# Altium schematic sheet Mis - AFE LMP91000.SchDoc
size Letter
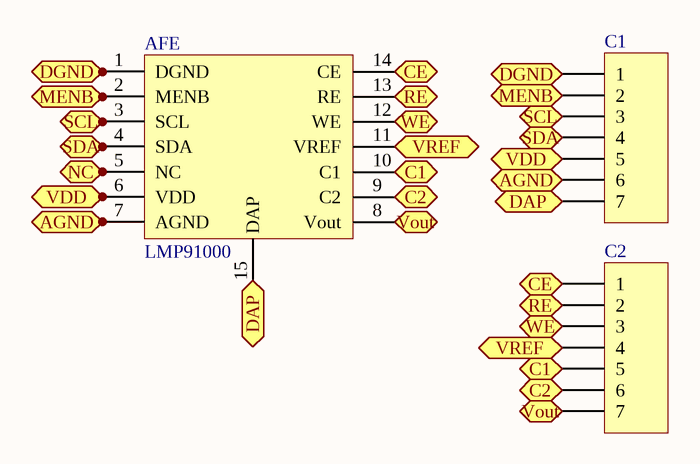
[diagram p0: Mis - AFE LMP91000.SchDoc]

## Parts
AFE  LMP91000  [WSON14]
C1  Header 7  [HDR1X7]  (value not drawn)
C2  Header 7  [HDR1X7]  (value not drawn)

## Ports
AGND, C1, C2, CE, DAP, DGND, MENB, NC, RE, SCL, SDA, VDD, Vout, VREF, WE

## Nets
AGND: AFE.7(AGND) C1.6 ; port AGND
C1: AFE.10(C1) C2.5 ; port C1
C2: AFE.9(C2) C2.6 ; port C2
CE: AFE.14(CE) C2.1 ; port CE
DAP: AFE.15(DAP) C1.7 ; port DAP
DGND: AFE.1(DGND) C1.1 ; port DGND
MENB: AFE.2(MENB) C1.2 ; port MENB
NC: AFE.5(NC) ; port NC
RE: AFE.13(RE) C2.2 ; port RE
SCL: AFE.3(SCL) C1.3 ; port SCL
SDA: AFE.4(SDA) C1.4 ; port SDA
VDD: AFE.6(VDD) C1.5 ; port VDD
Vout: AFE.8(Vout) C2.7 ; port Vout
VREF: AFE.11(VREF) C2.4 ; port VREF
WE: AFE.12(WE) C2.3 ; port WE

## Library data of the parts
C1 C2 = Header 7: Header, 7-Pin; LatestRevisionDate: 17-Jul-2002; LatestRevisionNote: Re-released for DXP Platform.; Publisher: Altium Limited